# EAGLE design Main-Board (EAGLE 9.5.2)

## Sheet 1 of 3: Main
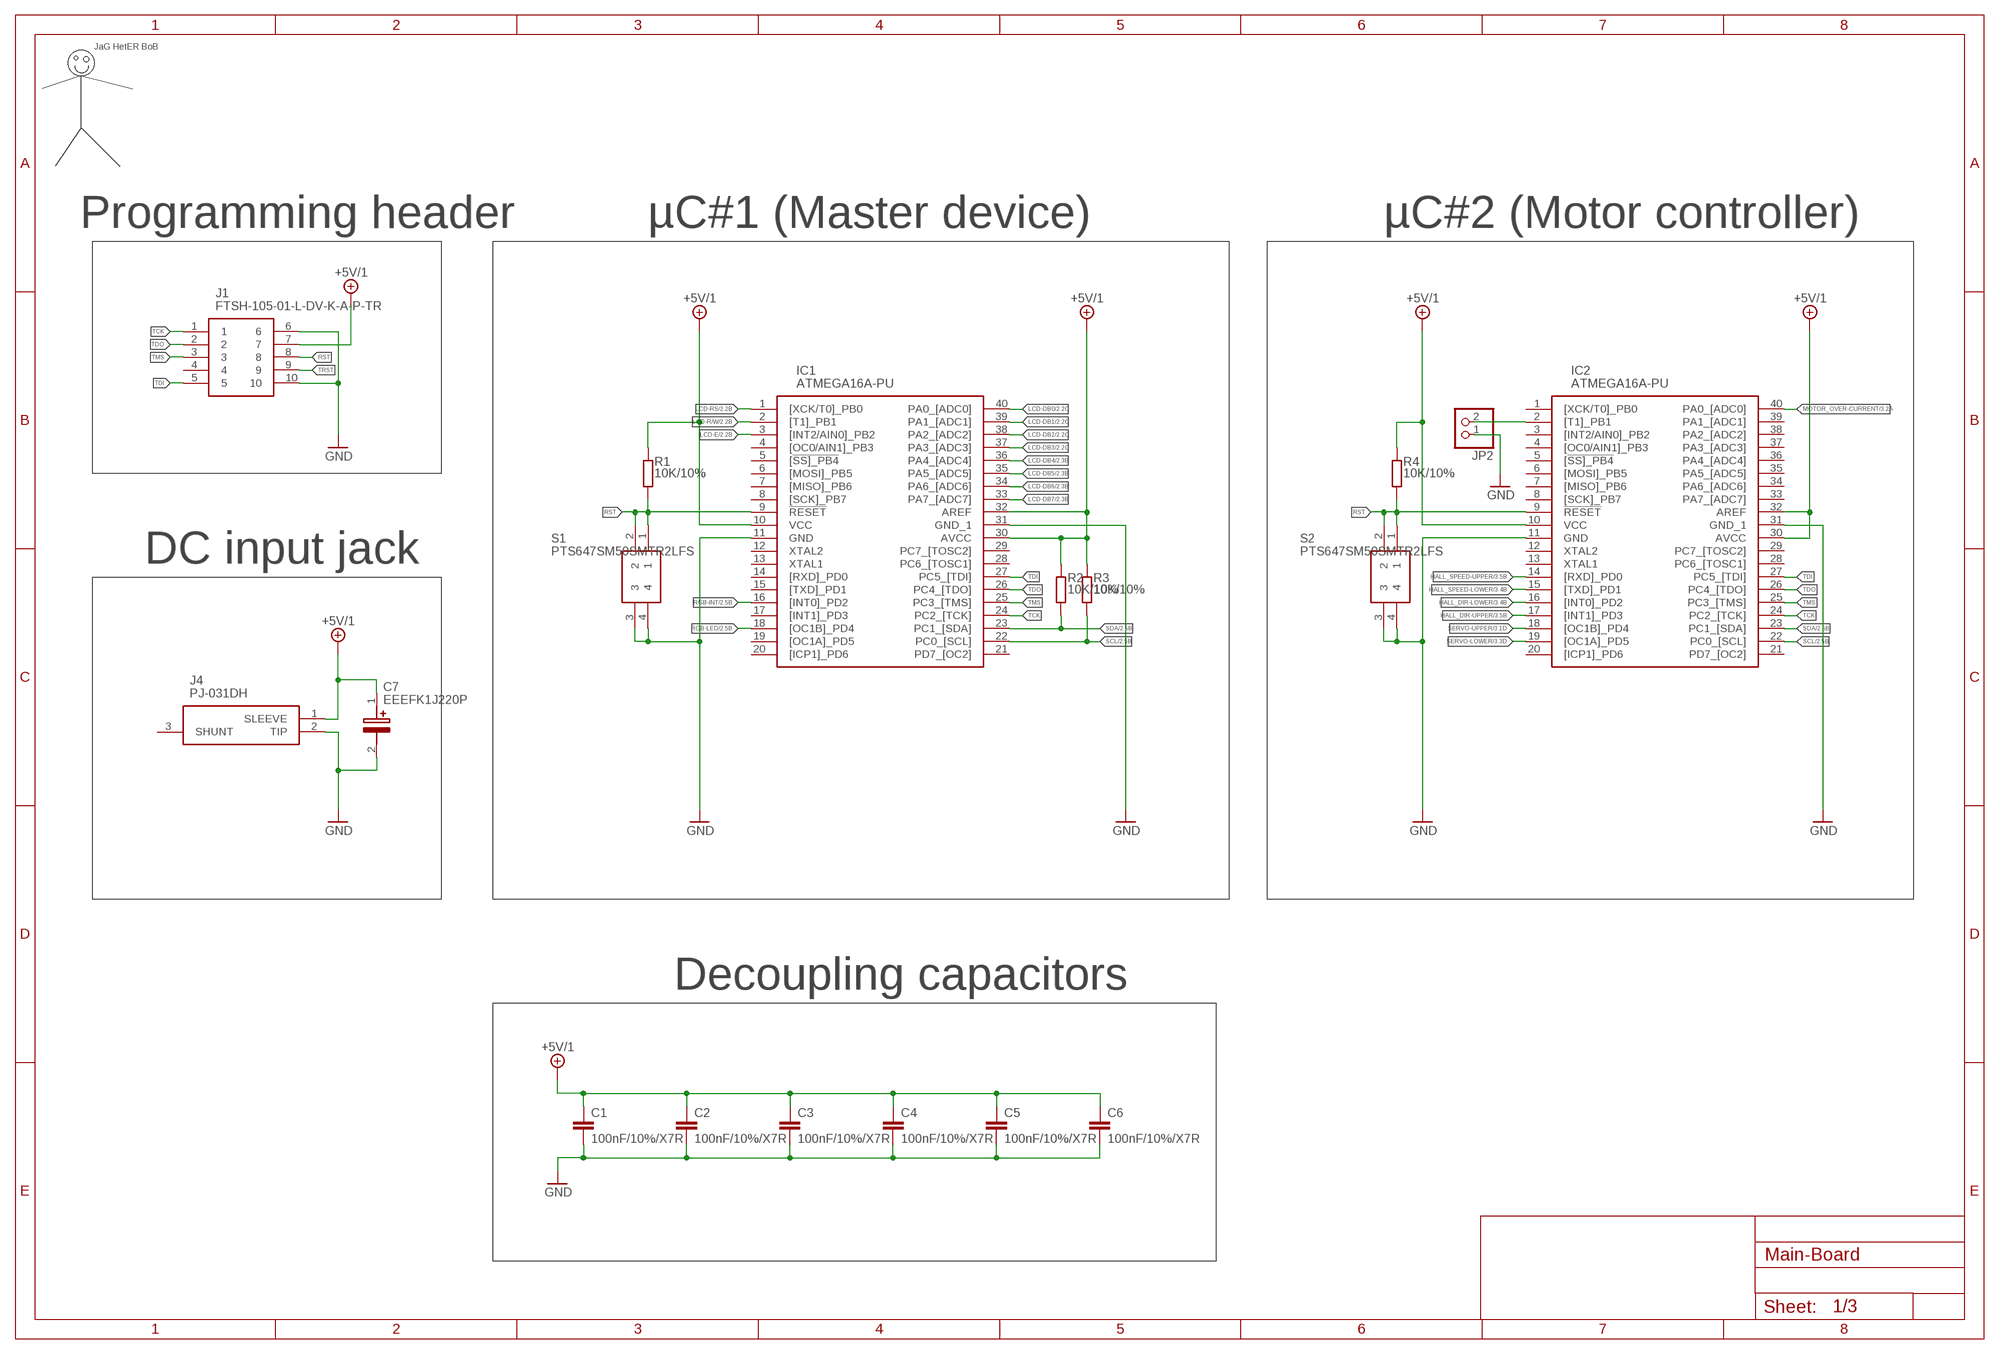
[diagram p0: schematic, sheet 1]

### Parts
C1  100nF/10%/X7R  C-EUC0603  [C0603]
C2  100nF/10%/X7R  C-EUC0603  [C0603]
C3  100nF/10%/X7R  C-EUC0603  [C0603]
C4  100nF/10%/X7R  C-EUC0603  [C0603]
C5  100nF/10%/X7R  C-EUC0603  [C0603]
C6  100nF/10%/X7R  C-EUC0603  [C0603]
C7  EEEFK1J220P  [CAPAE800X650N]
IC1  ATMEGA16A-PU  [DIP1556W56P254L5232H483Q40N]
IC2  ATMEGA16A-PU  [DIP1556W56P254L5232H483Q40N]
J1  FTSH-105-01-L-DV-K-A-P-TR  [FTSH10501LDVKAPTR]
J4  PJ-031DH  [PJ031DH]
JP2  PINHD-1X2  [1X02]
R1  10K/10%  R-EU_R0603  [R0603]
R2  10K/10%  R-EU_R0603  [R0603]
R3  10K/10%  R-EU_R0603  [R0603]
R4  10K/10%  R-EU_R0603  [R0603]
S1  PTS647SM50SMTR2LFS  [PTS647SM50SMTR2LFS]
S2  PTS647SM50SMTR2LFS  [PTS647SM50SMTR2LFS]

### Nets
+5V/1: C1.1 C2.1 C3.1 C4.1 C5.1 C6.1 C7.1(+) IC1.10(VCC) IC1.30(AVCC) IC1.32(AREF) IC2.10(VCC) IC2.30(AVCC) IC2.32(AREF) J1.7 J4.1(SLEEVE) R1.2 R2.2 R3.2 R4.2 ; also sheet 2,3
GND: C1.2 C2.2 C3.2 C4.2 C5.2 C6.2 C7.2(-) IC1.11(GND) IC1.31(GND_1) IC2.11(GND) IC2.31(GND_1) J1.6 J1.10 J4.2(TIP) JP2.1 S1.3 S1.4 S2.3 S2.4 ; also sheet 2,3
HALL_DIR-LOWER: IC2.16([INT0]_PD2) ; also sheet 3
HALL_DIR-UPPER: IC2.17([INT1]_PD3) ; also sheet 3
HALL_SPEED-LOWER: IC2.15([TXD]_PD1) ; also sheet 3
HALL_SPEED-UPPER: IC2.14([RXD]_PD0) ; also sheet 3
LCD-DB0: IC1.40(PA0_[ADC0]) ; also sheet 2
LCD-DB1: IC1.39(PA1_[ADC1]) ; also sheet 2
LCD-DB2: IC1.38(PA2_[ADC2]) ; also sheet 2
LCD-DB3: IC1.37(PA3_[ADC3]) ; also sheet 2
LCD-DB4: IC1.36(PA4_[ADC4]) ; also sheet 2
LCD-DB5: IC1.35(PA5_[ADC5]) ; also sheet 2
LCD-DB6: IC1.34(PA6_[ADC6]) ; also sheet 2
LCD-DB7: IC1.33(PA7_[ADC7]) ; also sheet 2
LCD-E: IC1.3([INT2/AIN0]_PB2) ; also sheet 2
LCD-R/W: IC1.2([T1]_PB1) ; also sheet 2
LCD-RS: IC1.1([XCK/T0]_PB0) ; also sheet 2
MOTOR_OVER-CURRENT: IC2.40(PA0_[ADC0]) ; also sheet 3
N$3: IC2.2([T1]_PB1) JP2.2
RGB-INT: IC1.16([INT0]_PD2) ; also sheet 2
RGB-LED: IC1.18([OC1B]_PD4) ; also sheet 2
RST: IC1.9(!RESET) IC2.9(!RESET) J1.8 R1.1 R4.1 S1.1 S1.2 S2.1 S2.2
SCL: IC1.22(PC0_[SCL]) IC2.22(PC0_[SCL]) R3.1 ; also sheet 2
SDA: IC1.23(PC1_[SDA]) IC2.23(PC1_[SDA]) R2.1 ; also sheet 2
SERVO-LOWER: IC2.19([OC1A]_PD5) ; also sheet 3
SERVO-UPPER: IC2.18([OC1B]_PD4) ; also sheet 3
TCK: IC1.24(PC2_[TCK]) IC2.24(PC2_[TCK]) J1.1
TDI: IC1.27(PC5_[TDI]) IC2.27(PC5_[TDI]) J1.5
TDO: IC1.26(PC4_[TDO]) IC2.26(PC4_[TDO]) J1.2
TMS: IC1.25(PC3_[TMS]) IC2.25(PC3_[TMS]) J1.3
TRST: J1.9
Unconnected: IC1.4([OC0/AIN1]_PB3) IC1.5([!SS]_PB4) IC1.6([MOSI]_PB5) IC1.7([MISO]_PB6) IC1.8([SCK]_PB7) IC1.12(XTAL2) IC1.13(XTAL1) IC1.14([RXD]_PD0) IC1.15([TXD]_PD1) IC1.17([INT1]_PD3) IC1.19([OC1A]_PD5) IC1.20([ICP1]_PD6) IC1.21(PD7_[OC2]) IC1.28(PC6_[TOSC1]) IC1.29(PC7_[TOSC2]) IC2.1([XCK/T0]_PB0) IC2.3([INT2/AIN0]_PB2) IC2.4([OC0/AIN1]_PB3) IC2.5([!SS]_PB4) IC2.6([MOSI]_PB5) IC2.7([MISO]_PB6) IC2.8([SCK]_PB7) IC2.12(XTAL2) IC2.13(XTAL1) IC2.20([ICP1]_PD6) IC2.21(PD7_[OC2]) IC2.28(PC6_[TOSC1]) IC2.29(PC7_[TOSC2]) IC2.33(PA7_[ADC7]) IC2.34(PA6_[ADC6]) IC2.35(PA5_[ADC5]) IC2.36(PA4_[ADC4]) IC2.37(PA3_[ADC3]) IC2.38(PA2_[ADC2]) IC2.39(PA1_[ADC1]) J1.4 J4.3(SHUNT)

### Notes on the sheet
- JaG HetER BoB
- Programming header | µC#1 (Master device) | µC#2 (Motor controller)
- DC input jack
- Decoupling capacitors

## Sheet 2 of 3: Peripherals
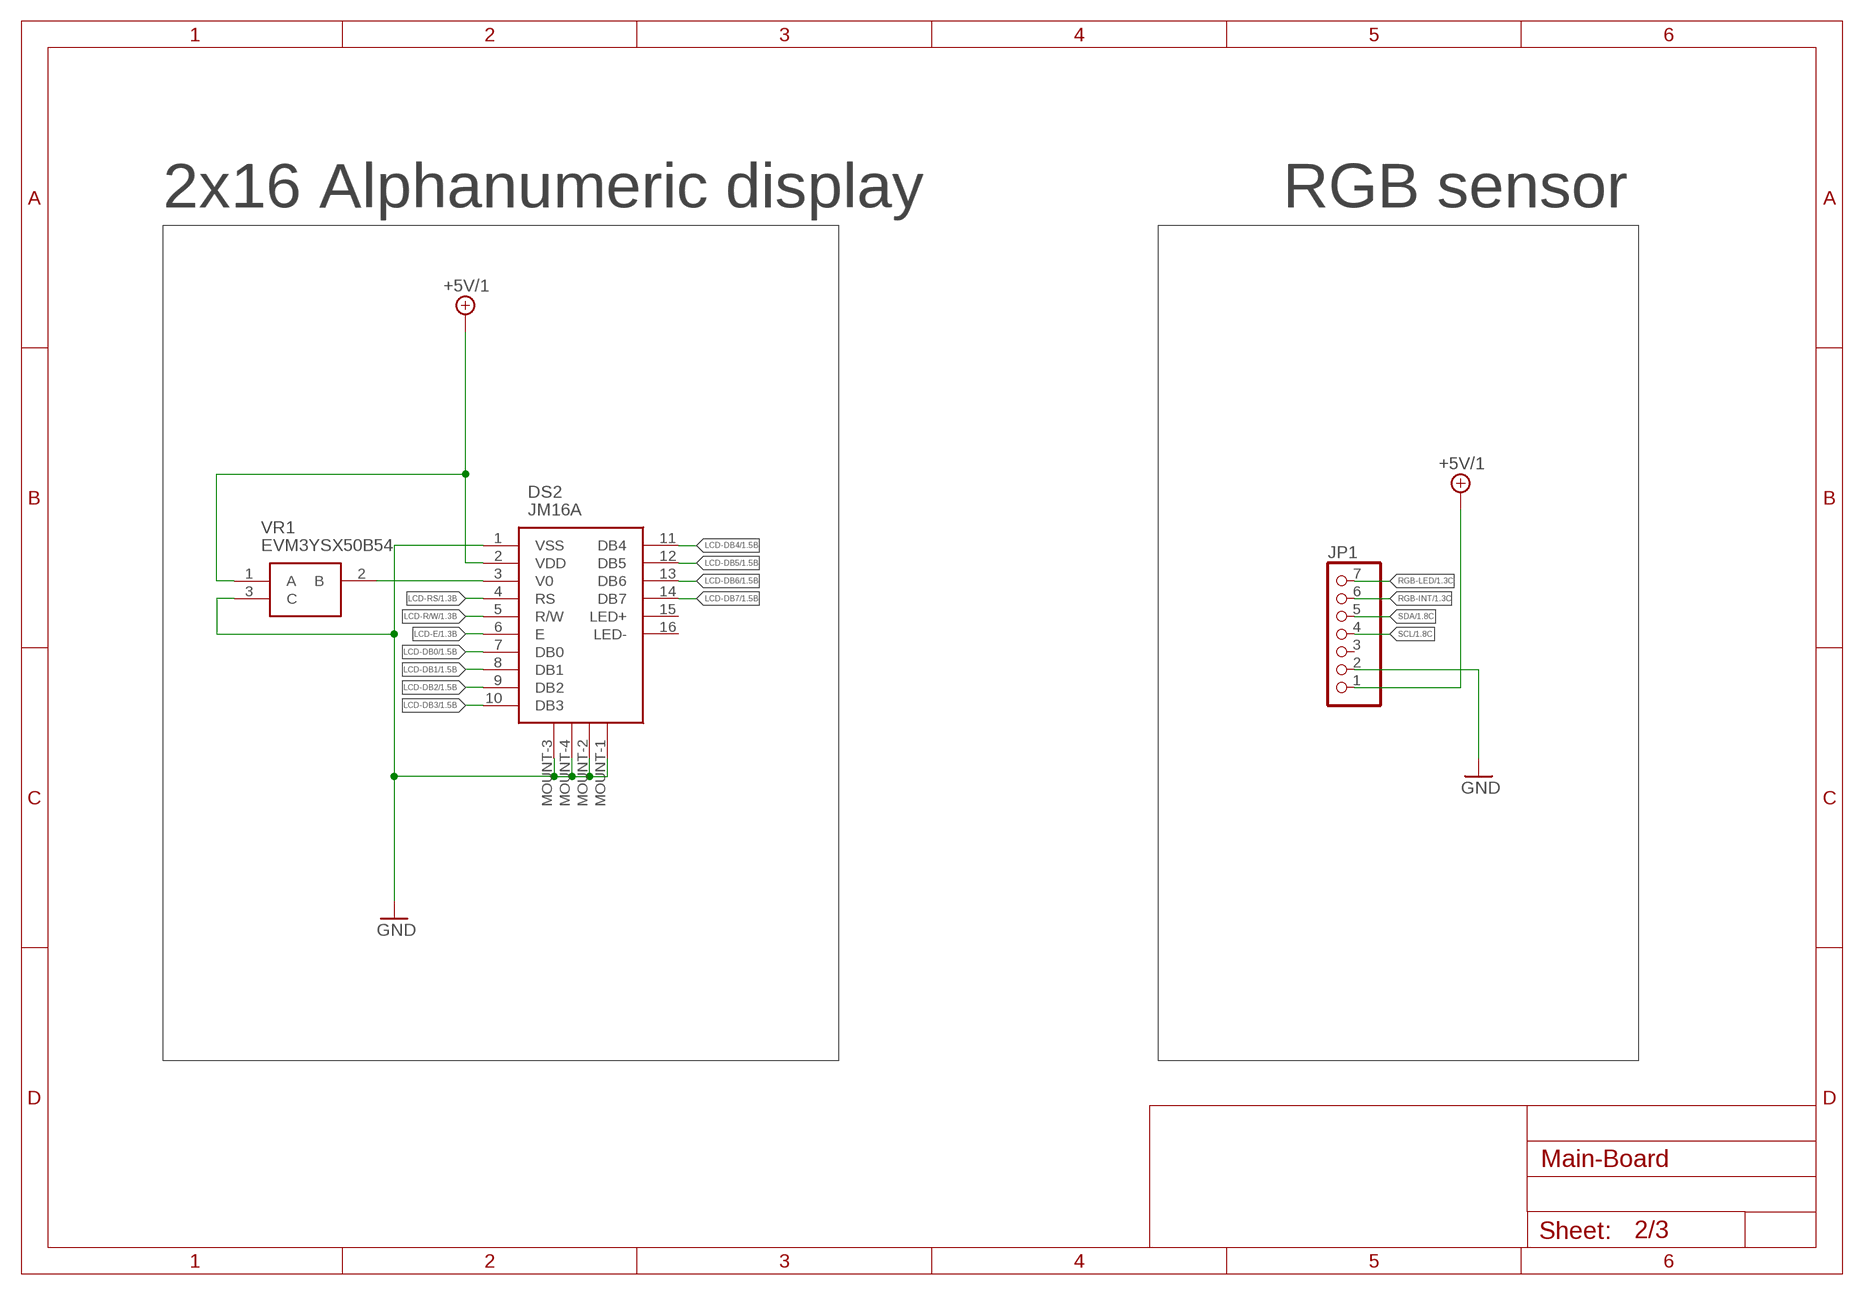
[diagram p1: schematic, sheet 2]

### Parts
DS2  JM16A  [JM16A]
JP1  PINHD-1X7  [1X07]
VR1  EVM3YSX50B54  [EVM3YSX50B54]

### Nets
+5V/1: DS2.2(VDD) JP1.1 VR1.1(A) ; also sheet 1,3
GND: DS2.1(VSS) DS2.MOUNT-1(MOUNT-4) DS2.MOUNT-2(MOUNT-3) DS2.MOUNT-3(MOUNT-1) DS2.MOUNT-4(MOUNT-2) JP1.2 VR1.3(C) ; also sheet 1,3
LCD-DB0: DS2.7(DB0) ; also sheet 1
LCD-DB1: DS2.8(DB1) ; also sheet 1
LCD-DB2: DS2.9(DB2) ; also sheet 1
LCD-DB3: DS2.10(DB3) ; also sheet 1
LCD-DB4: DS2.11(DB4) ; also sheet 1
LCD-DB5: DS2.12(DB5) ; also sheet 1
LCD-DB6: DS2.13(DB6) ; also sheet 1
LCD-DB7: DS2.14(DB7) ; also sheet 1
LCD-E: DS2.6(E) ; also sheet 1
LCD-R/W: DS2.5(R/W) ; also sheet 1
LCD-RS: DS2.4(RS) ; also sheet 1
N$2: DS2.3(V0) VR1.2(B)
RGB-INT: JP1.6 ; also sheet 1
RGB-LED: JP1.7 ; also sheet 1
SCL: JP1.4 ; also sheet 1
SDA: JP1.5 ; also sheet 1
Unconnected: DS2.15(LED+) DS2.16(LED-) JP1.3

### Notes on the sheet
- 2x16 Alphanumeric display | RGB sensor

## Sheet 3 of 3: Motor
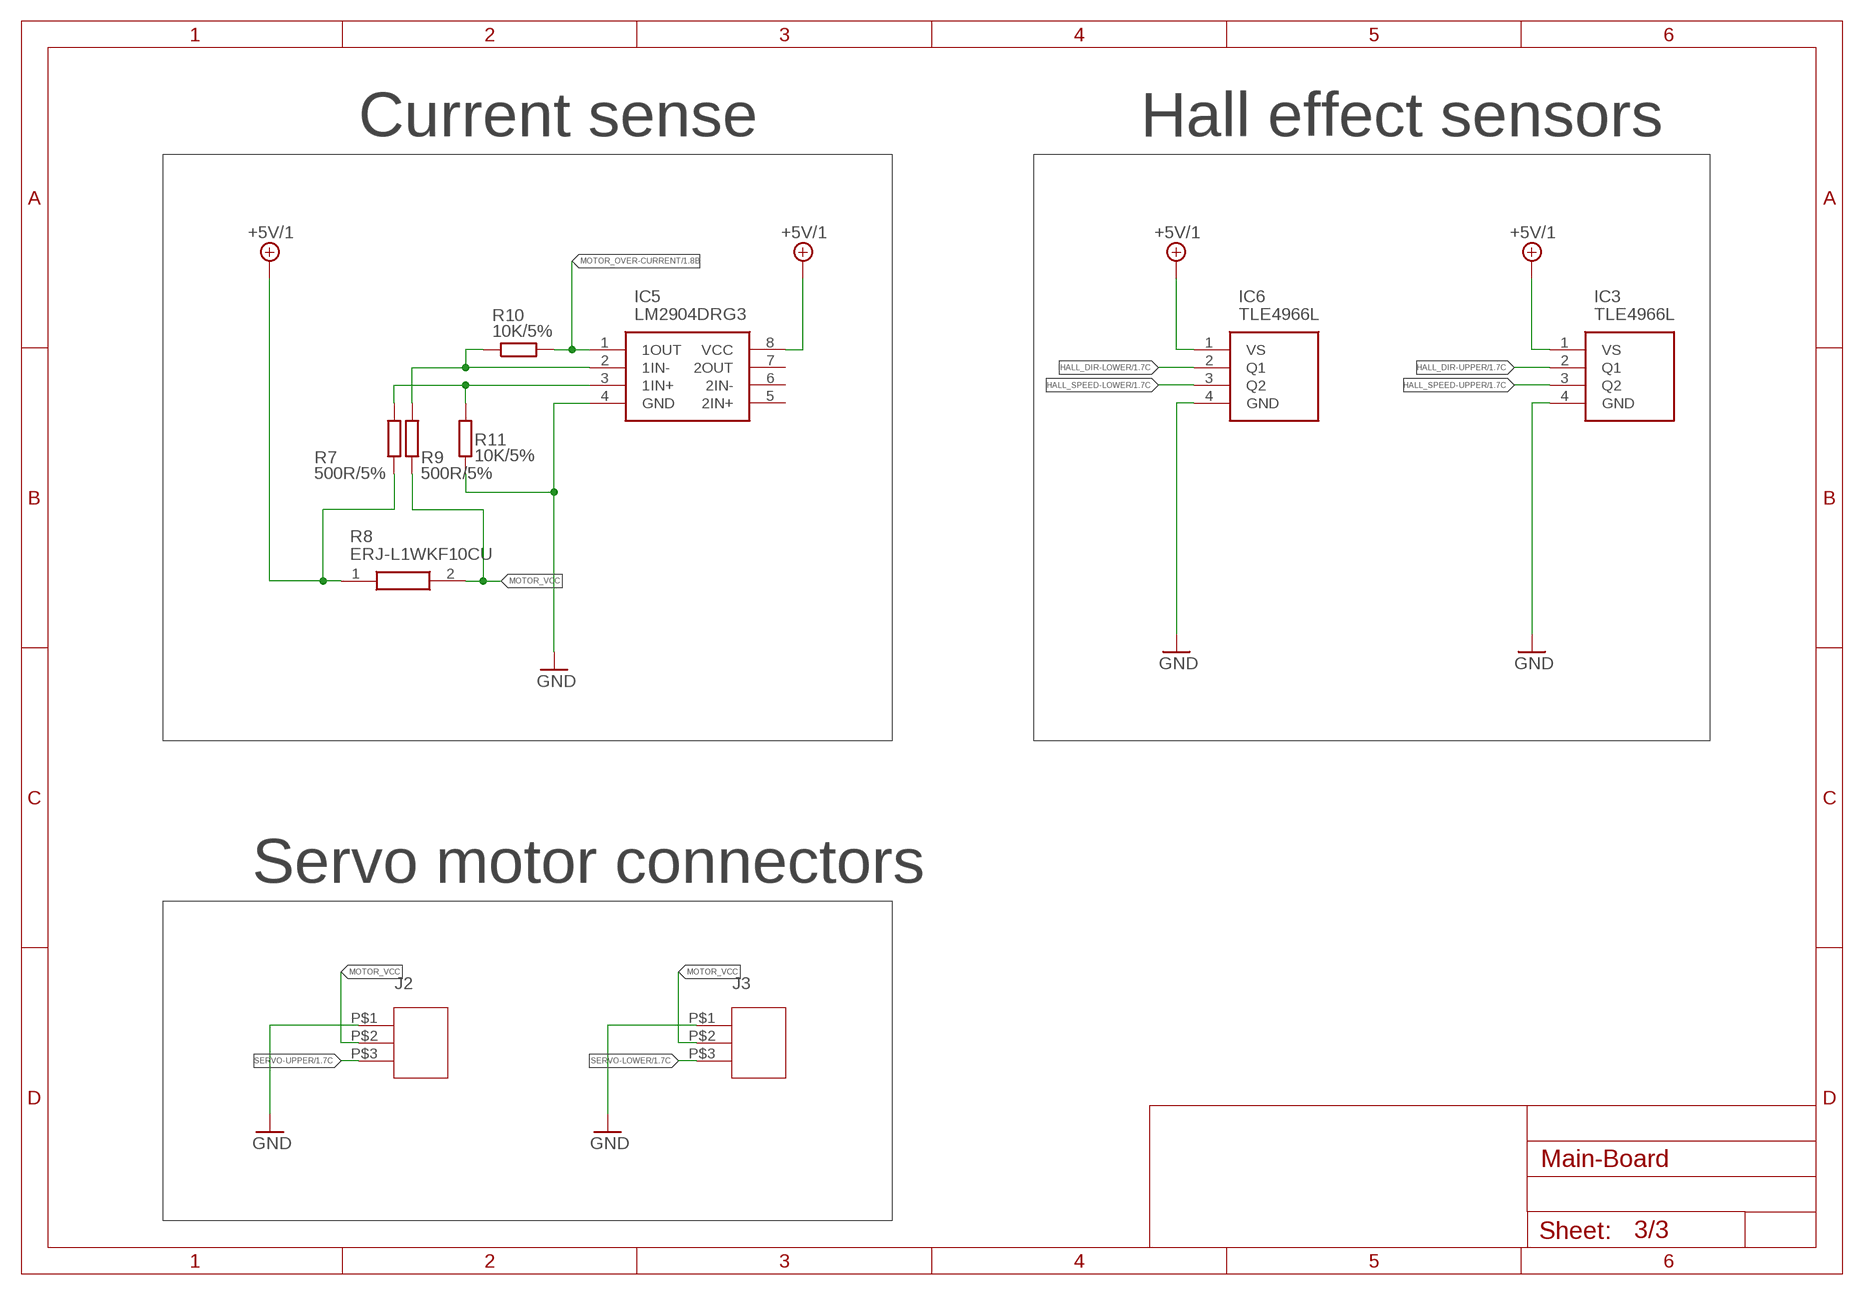
[diagram p2: schematic, sheet 3]

### Parts
IC3  TLE4966L  [TLE4966L]
IC5  LM2904DRG3  [SOIC127P600X175-8N]
IC6  TLE4966L  [TLE4966L]
J2  0022288033  [0022288033]
J3  0022288033  [0022288033]
R7  500R/5%  R-EU_R0603  [R0603]
R8  ERJ-L1WKF10CU  [RESC6332X120N]
R9  500R/5%  R-EU_R0603  [R0603]
R10  10K/5%  R-EU_R0603  [R0603]
R11  10K/5%  R-EU_R0603  [R0603]

### Nets
+5V/1: IC3.1(VS) IC5.8(VCC) IC6.1(VS) R7.1 R8.1(R1) ; also sheet 1,2
GND: IC3.4(GND) IC5.4(GND) IC6.4(GND) J2.P$1 J3.P$1 R11.1 ; also sheet 1,2
HALL_DIR-LOWER: IC6.2(Q1) ; also sheet 1
HALL_DIR-UPPER: IC3.2(Q1) ; also sheet 1
HALL_SPEED-LOWER: IC6.3(Q2) ; also sheet 1
HALL_SPEED-UPPER: IC3.3(Q2) ; also sheet 1
MOTOR_OVER-CURRENT: IC5.1(1OUT) R10.2 ; also sheet 1
MOTOR_VCC: J2.P$2 J3.P$2 R8.2(R2) R9.1
N$1: IC5.3(1IN+) R7.2 R11.2
N$5: IC5.2(1IN-) R9.2 R10.1
SERVO-LOWER: J3.P$3 ; also sheet 1
SERVO-UPPER: J2.P$3 ; also sheet 1
Unconnected: IC5.5(2IN+) IC5.6(2IN-) IC5.7(2OUT)

### Notes on the sheet
- Current sense | Hall effect sensors
- Servo motor connectors

## Library data of the parts
C1-C6 = rcl:C-EU: CAPACITOR, European symbol; SPICEPREFIX: C
C7 = SamacSys_Parts:EEEFK1J220P: Panasonic Aluminium Electrolytic Capacitor 22uF 63V dc 8mm E FK SMD Series, Surface Mount Electrolytic, +/-20% Source: Datasheet <https://industrial.panasonic.com/cdbs/www-data/pdf/RDE0000/ABA0000C1181.pdf>; DESCRIPTION: Panasonic Aluminium Electrolytic Capacitor 22uF 63V dc 8mm E FK SMD Series, Surface Mount Electrolytic, +/-20%; HEIGHT: 6.5mm; MANUFACTURER_NAME: Panasonic; MANUFACTURER_PART_NUMBER: EEEFK1J220P; RS_PART_NUMBER: 7083598P; RS_PRICE-STOCK: http://uk.rs-online.com/web/p/products/7083598P
DS2 = JM16A-Vanheden:JM16A: LCD Character Display Modules & Accessories STN- GRAY Transfl 80.0 x 36.0 Source: Datasheet <http://www.newhavendisplay.com/specs/NHD-0216XZ-FSW-GBW.pdf>; ALLIED_NUMBER: 70518104; ALLIED_PRICE-STOCK: https://www.alliedelec.com/newhaven-display-international-nhd-0216xz-fsw-gbw/70518104/; DESCRIPTION: LCD Character Display Modules & Accessories STN- GRAY Transfl 80.0 x 36.0; HEIGHT: 7mm; MANUFACTURER_NAME: Newhaven Display; MANUFACTURER_PART_NUMBER: NHD-0216XZ-FSW-GBW; MOUSER_PART_NUMBER: 763-0216XZ-FSW-GBW; MOUSER_PRICE-STOCK: https://www.mouser.com/Search/Refine.aspx?Keyword=763-0216XZ-FSW-GBW
IC1 IC2 = SamacSys_Parts:ATMEGA16A-PU: ATMEGA16A-PU, 8 bit AVR Microcontroller 16MHz 16 kB, 512 B Flash, 1 kB RAM, I2C 40-Pin PDIP Source: Datasheet <http://www.atmel.com/images/atmel-8154-8-bit-avr-atmega16a_datasheet summary.pdf>; DESCRIPTION: ATMEGA16A-PU, 8 bit AVR Microcontroller 16MHz 16 kB, 512 B Flash, 1 kB RAM, I2C 40-Pin PDIP; HEIGHT: 4.826mm; MANUFACTURER_NAME: Microchip; MANUFACTURER_PART_NUMBER: ATMEGA16A-PU; MOUSER_PART_NUMBER: 556-ATMEGA16A-PU; MOUSER_PRICE-STOCK: https://www.mouser.com/Search/Refine.aspx?Keyword=556-ATMEGA16A-PU; RS_PART_NUMBER: 6962421P; RS_PRICE-STOCK: http://uk.rs-online.com/web/p/products/6962421P
IC3 IC6 = SamacSys_Parts:TLE4966L: Infineon TLE4966L, Bipolar Hall Effect Sensor Switch 4-Pin SSO, 2.7 26 V Source: Datasheet <https://www.infineon.com/dgdl/Infineon-TLE4966L-DS-v02_00-en.pdf?fileId=db3a304319c6f18c0119cd85b86f7ad7>; DESCRIPTION: Infineon TLE4966L, Bipolar Hall Effect Sensor Switch 4-Pin SSO, 2.7 26 V; HEIGHT: 3.89mm; MANUFACTURER_NAME: Infineon; MANUFACTURER_PART_NUMBER: TLE4966L; MOUSER_PART_NUMBER: 726-TLE4966L; MOUSER_PRICE-STOCK: https://www.mouser.com/Search/Refine.aspx?Keyword=726-TLE4966L
IC5 = SamacSys_Parts:LM2904DRG3: Dual general-purpose operational amplifier Source: Datasheet <http://www.ti.com/lit/gpn/lm2904>; DESCRIPTION: Dual general-purpose operational amplifier; HEIGHT: mm; MANUFACTURER_NAME: Texas Instruments; MANUFACTURER_PART_NUMBER: LM2904DRG3; MOUSER_PART_NUMBER: 595-LM2904DRG3; MOUSER_PRICE-STOCK: https://www.mouser.com/Search/Refine.aspx?Keyword=595-LM2904DRG3
J1 = SamacSys_Parts:FTSH-105-01-L-DV-K-A-P-TR: Samtec FTSH, 1.27mm Pitch, 10 Way, 2 Row PCB Terminal Block Header, Surface Mount, Through Hole Source: Datasheet <http://suddendocs.samtec.com/prints/ftsh-1xx-xx-xxx-dv-xxx-xxx-mkt.pdf>; DESCRIPTION: Samtec FTSH, 1.27mm Pitch, 10 Way, 2 Row PCB Terminal Block Header, Surface Mount, Through Hole; HEIGHT: 6.1mm; MANUFACTURER_NAME: SAMTEC; MANUFACTURER_PART_NUMBER: FTSH-105-01-L-DV-K-A-P-TR; MOUSER_PART_NUMBER: 200-FTSH1051LDVKAPTR; MOUSER_PRICE-STOCK: https://www.mouser.com/Search/Refine.aspx?Keyword=200-FTSH1051LDVKAPTR; RS_PART_NUMBER: 1802978P; RS_PRICE-STOCK: http://uk.rs-online.com/web/p/products/1802978P
J2 J3 = 0022288033:0022288033
J4 = SamacSys_Parts:PJ-031DH: DC Power Connectors Power Jacks Source: Datasheet <https://www.cuidevices.com/product/resource/pj-031dh.pdf>; DESCRIPTION: DC Power Connectors Power Jacks; HEIGHT: 7.4mm; MANUFACTURER_NAME: CUI Devices; MANUFACTURER_PART_NUMBER: PJ-031DH; MOUSER_PART_NUMBER: 490-PJ-031DH; MOUSER_PRICE-STOCK: https://www.mouser.com/Search/Refine.aspx?Keyword=490-PJ-031DH
JP1 = pinhead:PINHD-1X7: PIN HEADER
JP2 = pinhead:PINHD-1X2: PIN HEADER
R1-R4 R7 R9-R11 = rcl:R-EU_: RESISTOR, European symbol; SPICEPREFIX: R
R8 = SamacSys_Parts:ERJ-L1WKF10CU: RESISTOR, 2512 100 mOhm +/-1% 1W Source: Datasheet <http://componentsearchengine.com/Datasheets/1/ERJ-L1WKF10CU.pdf>; ALLIED_NUMBER: 70260913; ALLIED_PRICE-STOCK: https://www.alliedelec.com/panasonic-erj-l1wkf10cu/70260913/; DESCRIPTION: RESISTOR, 2512 100 mOhm +/-1% 1W; HEIGHT: mm; MANUFACTURER_NAME: Panasonic; MANUFACTURER_PART_NUMBER: ERJ-L1WKF10CU; MOUSER_PART_NUMBER: 667-ERJ-L1WKF10CU; MOUSER_PRICE-STOCK: https://www.mouser.com/Search/Refine.aspx?Keyword=667-ERJ-L1WKF10CU
S1 S2 = SamacSys_Parts:PTS647SM50SMTR2LFS: Tactile Switches 50mA 12VDC, 1.8N 5.0mm H, G leads Source: Datasheet <https://www.ckswitches.com/media/2567/pts647.pdf>; DESCRIPTION: Tactile Switches 50mA 12VDC, 1.8N 5.0mm H, G leads; HEIGHT: 5.25mm; MANUFACTURER_NAME: C & K COMPONENTS; MANUFACTURER_PART_NUMBER: PTS647SM50SMTR2LFS; MOUSER_PART_NUMBER: 611-PTS647SM50SMTR2L; MOUSER_PRICE-STOCK: https://www.mouser.com/Search/Refine.aspx?Keyword=611-PTS647SM50SMTR2L
VR1 = SamacSys_Parts:EVM3YSX50B54: SMD Cermet Trimmer Pot, 3mm Sq, 50K Source: Datasheet <http://docs-emea.rs-online.com/webdocs/0f7f/0900766b80f7fa29.pdf>; ALLIED_NUMBER: 70348375; ALLIED_PRICE-STOCK: http://www.alliedelec.com/panasonic-evm3ysx50b54/70348375/; DESCRIPTION: SMD Cermet Trimmer Pot, 3mm Sq, 50K; HEIGHT: 1.55mm; MANUFACTURER_NAME: Panasonic; MANUFACTURER_PART_NUMBER: EVM3YSX50B54; RS_PART_NUMBER: 7312880; RS_PRICE-STOCK: https://uk.rs-online.com/web/p/products/7312880

## Board
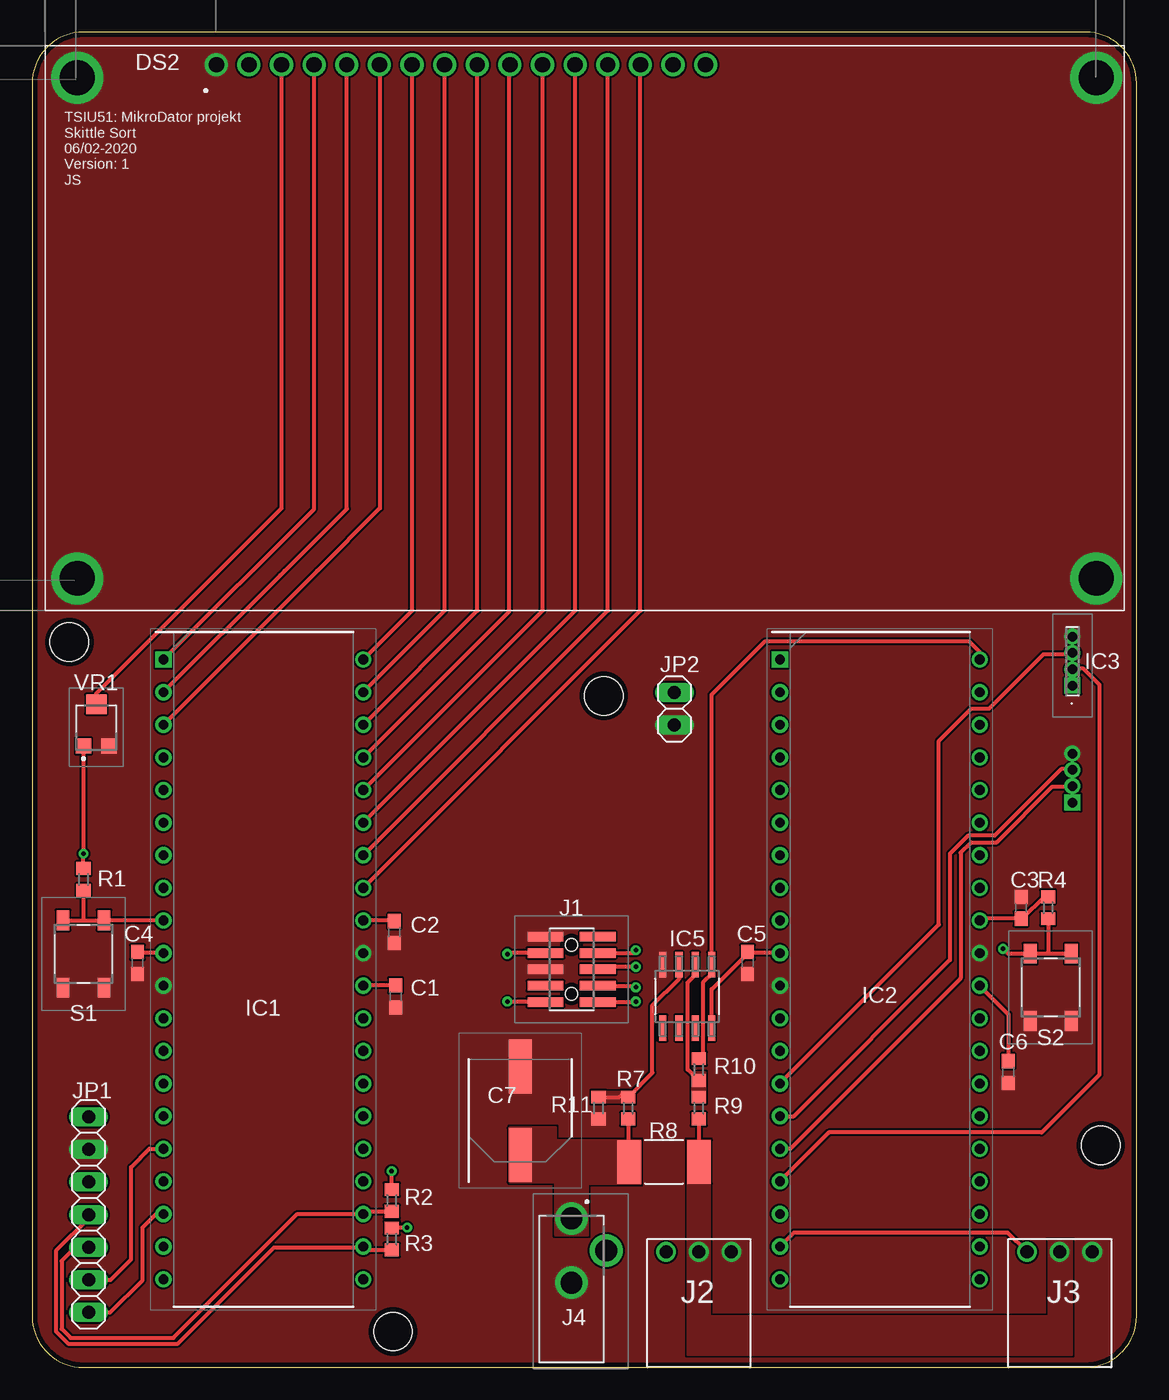
[diagram p3: board, top side]
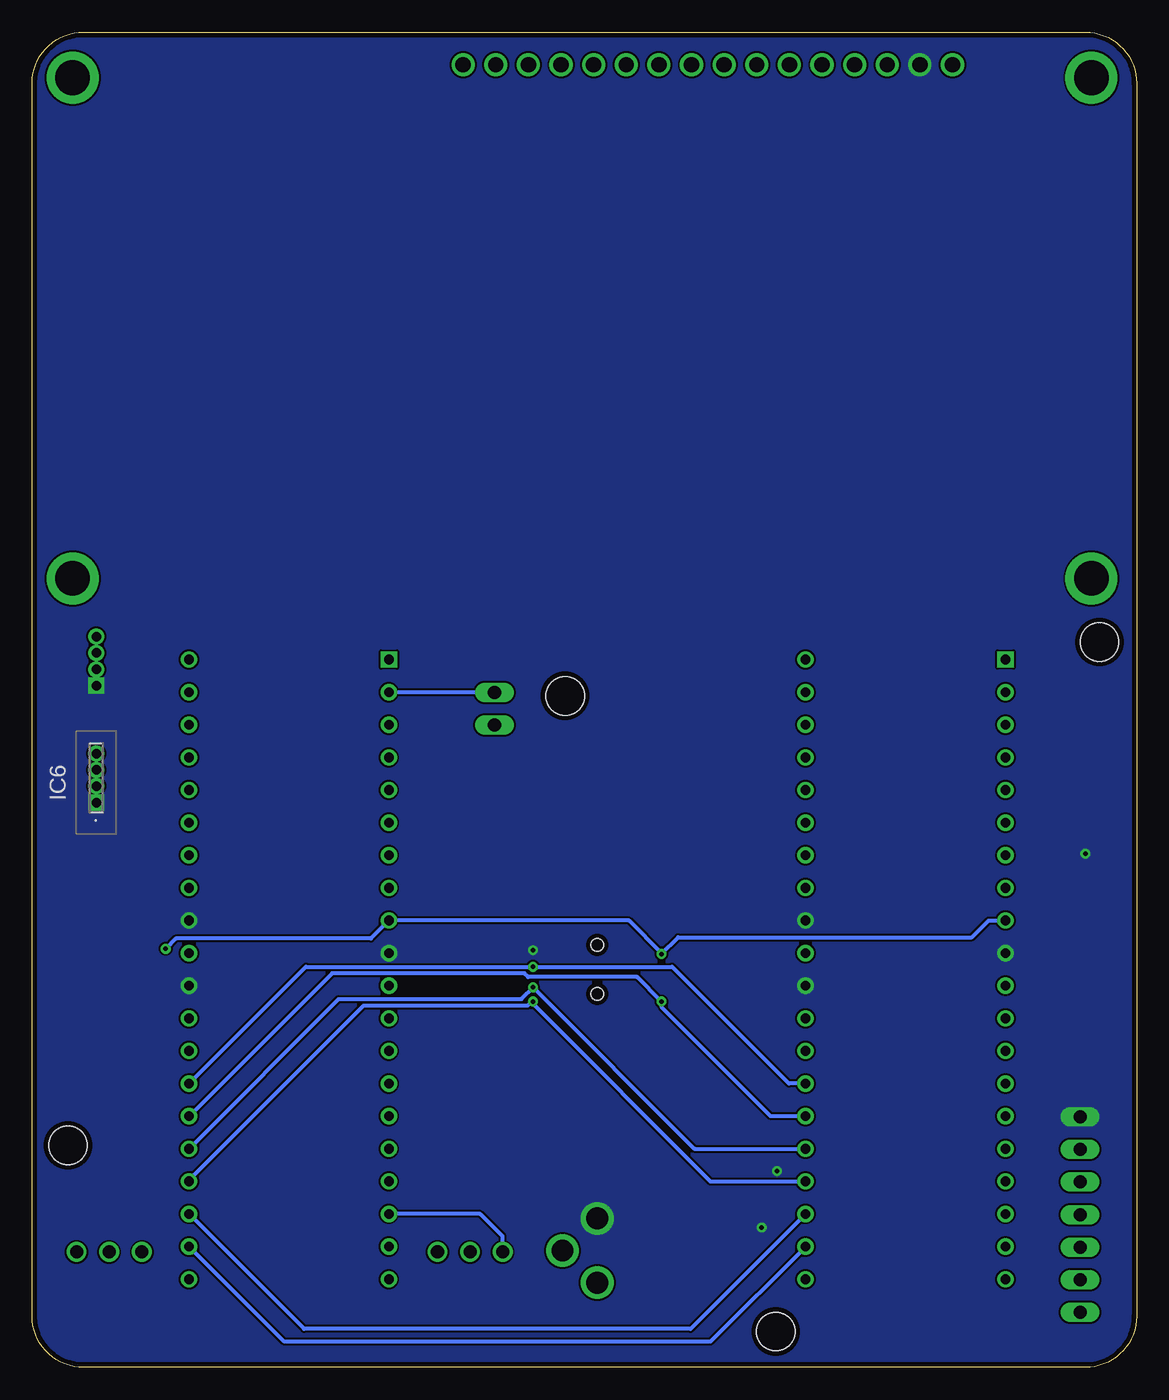
[diagram p4: board, bottom side, seen from below]

Size 86 x 104 mm. Coordinates in mm from the lower left corner, seen from the top.
Outline: 86,4 86,100 arc90 82,104 4,104 arc90 0,100 0,4 arc90 4,0 82,0 arc90 86,4
Copper layers (1*16): Top 0.035mm / dielectric 1.5mm / Bottom 0.035mm
Design rules "default *": minimum track width 6mil, minimum drill 0.35mm, track to track 6mil, track to pad 6mil, pad to pad 6mil, via to via 6mil, smd to smd 6mil, copper to edge 15mil, drill to drill 6mil, minimum pad ring 10mil, minimum via ring 8mil, stop-mask expansion 4mil, vias tented up to drill 20mil, thermal gap 10mil
Holes 3 mm at 28.1,2.8 2.9,56.5 83.2,17.3 44.5,52.3

### Footprints (pad centres in the part's own frame; a part is rotated, then mirrored left to right if it is on the bottom)
C0603 = smd 1.1 x 1: 1 -0.85,0; 2 0.85,0
CAPAE800X650N = smd 4.2 x 1.8: 1 -3.45,0; 2 3.45,0
JM16A = drill 1.2 pad 1.8: 1 13.34,-1.542; 2 15.88,-1.542; 3 18.42,-1.542; 4 20.96,-1.542; 5 23.5,-1.542; 6 26.04,-1.542; 7 28.58,-1.542; 8 31.12,-1.542; 9 33.66,-1.542; 10 36.2,-1.542; 11 38.74,-1.542; 12 41.28,-1.542; 13 43.82,-1.542; 14 46.36,-1.542; 15 48.9,-1.542; 16 51.44,-1.542 | drill 2.7 pad 4.05: MOUNT-1 2.521,-2.55; MOUNT-2 81.85,-2.55; MOUNT-3 2.521,-41.55; MOUNT-4 81.85,-41.55
DIP1556W56P254L5232H483Q40N = drill 0.759 pad 1.159 square: 1 -7.779,24.13 | drill 0.759 pad 1.159: 2 -7.779,21.59; 3 -7.779,19.05; 4 -7.779,16.51; 5 -7.779,13.97; 6 -7.779,11.43; 7 -7.779,8.89; 8 -7.779,6.35; 9 -7.779,3.81; 10 -7.779,1.27; 11 -7.779,-1.27; 12 -7.779,-3.81; 13 -7.779,-6.35; 14 -7.779,-8.89; 15 -7.779,-11.43; 16 -7.779,-13.97; 17 -7.779,-16.51; 18 -7.779,-19.05; 19 -7.779,-21.59; 20 -7.779,-24.13; 21 7.779,-24.13; 22 7.779,-21.59; 23 7.779,-19.05; 24 7.779,-16.51; 25 7.779,-13.97; 26 7.779,-11.43; 27 7.779,-8.89; 28 7.779,-6.35; 29 7.779,-3.81; 30 7.779,-1.27; 31 7.779,1.27; 32 7.779,3.81; 33 7.779,6.35; 34 7.779,8.89; 35 7.779,11.43; 36 7.779,13.97; 37 7.779,16.51; 38 7.779,19.05; 39 7.779,21.59; 40 7.779,24.13
TLE4966L = drill 0.74 pad 1.1 square: 1 0,0 | drill 0.74 pad 1.1: 2 1.27,0; 3 2.54,0; 4 3.81,0
SOIC127P600X175-8N = smd 1.981 x 0.559: 1 -2.464,1.905; 2 -2.464,0.635; 3 -2.464,-0.635; 4 -2.464,-1.905; 5 2.464,-1.905; 6 2.464,-0.635; 7 2.464,0.635; 8 2.464,1.905
FTSH10501LDVKAPTR = smd 0.74 x 2.79: 1 -2.54,-2.035; 2 -2.54,2.035; 3 -1.27,-2.035; 4 -1.27,2.035; 5 0,-2.035; 6 0,2.035; 7 1.27,-2.035; 8 1.27,2.035; 9 2.54,-2.035; 10 2.54,2.035 | hole 0.97: -1.905,0; 1.905,0
0022288033 = drill 1.02: P$1 -2.54,0; P$2 0,0; P$3 2.54,0
PJ031DH = drill 1.7 pad 2.5: 1 0,0; 2 -5,0; 3 -2.5,-2.7
1X07 = drill 1.016 long: 1 -7.62,0; 2 -5.08,0; 3 -2.54,0; 4 0,0; 5 2.54,0; 6 5.08,0; 7 7.62,0
1X02 = drill 1.016 long: 1 -1.27,0; 2 1.27,0
R0603 = smd 1 x 1.1: 1 -0.85,0; 2 0.85,0
RESC6332X120N = smd 1.854 x 3.404: 1 -2.718,0; 2 2.718,0
PTS647SM50SMTR2LFS = smd 1.55 x 1: 1 -2.625,1.6; 2 -2.625,-1.6; 3 2.625,-1.6; 4 2.625,1.6
EVM3YSX50B54 = smd 1.2 x 1.2: 1 -1,-1.6; 3 1,-1.6 | smd 1.6 x 1.5: 2 0,1.65

### Placement (x,y rotation side)
C1  28.3,28.9 270 top
C2  28.2,33.9 270 top
C3  77,35.8 90 top
C4  8.2,31.5 270 top
C5  55.7,31.5 270 top
C6  76,23 270 top
C7  38,20 90 top
DS2  1,103 0 top
IC1  18,31 0 top
IC2  66,31 0 top
IC3  81,53.1 90 top
IC5  51,28.9 270 top
IC6  81,44 90 bottom
J1  42,31 90 top
J2  51.9,9 180 top
J3  80,9 180 top
J4  42,11.6 90 top
JP1  4.4,11.9 270 top
JP2  50,51.3 90 top
R1  4,38 90 top
R2  28,13 90 top
R3  28,10 90 top
R4  79.1,35.8 90 top
R7  46.4,20.2 90 top
R8  49.2,16 0 top
R9  51.9,20.2 90 top
R10  51.9,23.2 90 top
R11  44.1,20.2 90 top
S1  4,32.2 270 top
S2  79.3,29.6 270 top
VR1  5,50 0 top

### Tracks (layer width: path | path; a pad name or v marks a point on that pad's centre or on a via)
+5V/1  (via drill 0.35)
  Top 0.305: J1.7 46.77,32.27 v47,32.5 | R2.2 v28,15.3 | R3.2 28.05,10.9 v29.2,10.9 | R1.2 v4,40 VR1.1 | C2.1 28.14,34.81 IC1.32 | C1.1 25.8,29.75 IC1.30 | IC1.10 8.28,32.27 C4.1 | IC2.32 73.92,34.95 C3.1 77.1,34.95 78.8,36.65 R4.2 | IC2.10 55.78,32.27 C5.1 55.7,32.25 52.91,29.45 IC5.8 | IC2.30 76,27.51 C6.1 | R7.1 46.4,16.08 R8.1
  pour Bottom (rank 3, no thermals): -2,104 86,104 86,-3 -2,-3
  pour Top (no thermals): 47.4,17.7 40.7,17.7 40.7,10.3 43.3,10.3 43.3,14.3 47.4,14.3
  pour Top (no thermals): 40.8,18.7 37.2,18.7 37.2,14.4 40.8,14.4
GND
  pour Top (rank 3, no thermals): -1,-1 -1,104 86,104 86,-1
HALL_DIR-LOWER
  Top 0.305: IC6.2 80.96,45.23 79.43,45.23 75.1,40.9 73.1,40.9 72.3,40.1 72.3,30.3 59.03,17.03 IC2.16
HALL_DIR-UPPER
  Top 0.305: IC3.2 81.06,54.43 81.85,54.43 83.1,53.18 83.1,22.8 78.6,18.3 62.03,18.3 IC2.17
HALL_SPEED-LOWER
  Top 0.305: IC6.3 80.94,46.6 80.12,46.6 74.94,41.43 72.89,41.43 71.46,39.99 71.46,31.72 59.31,19.57 IC2.15
HALL_SPEED-UPPER
  Top 0.305: IC2.14 70.6,34.49 70.6,48.8 73.1,51.3 74.5,51.3 78.74,55.54 80.9,55.54 IC3.3
LCD-DB0
  Top 0.305: IC1.40 29.58,58.93 DS2.7
LCD-DB1
  Top 0.305: IC1.39 32.12,58.93 DS2.8
LCD-DB2
  Top 0.305: DS2.9 34.66,58.93 IC1.38
LCD-DB3
  Top 0.305: IC1.37 37.13,58.87 37.13,101.39 DS2.10
LCD-DB4
  Top 0.305: DS2.11 39.74,58.93 IC1.36
LCD-DB5
  Top 0.305: DS2.12 42.28,58.93 IC1.35
LCD-DB6
  Top 0.305: DS2.13 44.82,58.93 IC1.34
LCD-DB7
  Top 0.305: DS2.14 47.36,58.93 IC1.33
LCD-E
  Top 0.305: IC1.3 22.09,61.91 22.2,62.03 27.09,66.91 27.09,101.41 DS2.6
LCD-R/W
  Top 0.305: IC1.2 19.32,61.68 19.66,62.03 24.5,66.87 DS2.5
LCD-RS
  Top 0.305: DS2.4 21.96,66.87 IC1.1
MOTOR_OVER-CURRENT
  Top 0.305: R10.2 52.22,24.37 52.22,29.98 52.91,30.66 IC5.1 52.91,52.41 57.03,56.53 72.98,56.53 73.78,55.73 IC2.40
MOTOR_VCC
  Top 0.305: R9.1 51.92,19.33 R8.2
  pour Top (no thermals): 51,17.7 51,1 81,1 81,9.9 79.1,9.9 79.1,4 52.8,4 52.8,17.7
N$1
  Top 0.305: R11.2 45.7,21.05 46.03,21.39 | IC5.3 50.37,30.27 48.3,28.2 48.3,22.95 R7.2
  pour Top (no thermals): 43.6,21.5 46.9,21.5 46.9,20.6 43.6,20.6
N$2
  Top 0.305: VR1.2 5,52.51 19.42,66.92 DS2.3
N$3
  Bottom 0.305: JP2.2 58.2,52.57 IC2.2
N$5
  Top 0.305: R10.1 51.05,23.2 51.05,29.97 51.63,30.56 IC5.2
  pour Top (no thermals): 51.4,20.6 51.4,23 52.4,23 52.4,20.6
RGB-INT
  Top 0.305: JP1.6 6.12,6.82 7.7,8.4 7.7,15.6 9.13,17.03 IC1.16
RGB-LED
  Top 0.305: JP1.7 6.08,4.28 8.6,6.8 8.6,10.9 9.65,11.95 IC1.18
RST  (via drill 0.35)
  Top 0.305: J1.8 37.07,32.27 v37,32.2 | S1.2 4,34.83 | 4,34.83 S1.1 10.21,34.83 IC1.9 | R1.1 4,34.83 | 79,32.23 S2.2 75.97,32.23 v75.6,32.6 | 79,32.23 S2.1 | R4.1 79.1,32.33 79,32.23
  Bottom 0.305: IC1.9 11.52,34.81 12.83,33.5 35.7,33.5 v37,32.2 37,32.3 39.51,34.81 IC2.9 59.63,33.4 74.8,33.4 v75.6,32.6
SCL
  Top 0.305: IC1.22 25.84,9.34 | 25.84,9.34 26.04,9.15 R3.1 | JP1.4 4.4,11.63 1.84,9.07 1.84,2.81 2.81,1.84 11.34,1.84 18.84,9.34 25.84,9.34
  Bottom 0.305: IC1.22 33.19,2 66.37,2 IC2.22
SDA
  Top 0.305: R2.1 25.98,12.15 IC1.23 20.65,11.95 11,2.3 3,2.3 2.3,3 2.3,8.3 3.36,9.36 JP1.5
  Bottom 0.305: IC1.23 34.73,3 64.83,3 IC2.23
SERVO-LOWER
  Top 0.305: J3.P$3 75.96,10.5 59.31,10.5 IC2.19
SERVO-UPPER
  Bottom 0.305: J2.P$3 49.36,10.2 51.11,11.95 IC2.18
TCK  (via drill 0.35)
  Top 0.305: J1.1 46.96,28.46 v47,28.5
  Bottom 0.305: v47,28.5 47,28.3 | IC2.24 73.78,14.59 60.2,28.17 47.43,28.17 47.15,28.45 47,28.3 | 47,28.3 33.19,14.49 IC1.24
TDI  (via drill 0.35)
  Top 0.305: v47,31.2 44.23,31.2 J1.5
  Bottom 0.305: IC2.27 64.68,31.21 v47.01,31.21 v47,31.2 36.17,31.2 27.08,22.11 IC1.27
TDO  (via drill 0.35)
  Top 0.305: J1.2 37.04,28.46 v37,28.5
  Bottom 0.305: IC1.26 28.48,19.57 37,28.09 v37,28.5 38.9,30.4 47.38,30.4 47.68,30.7 62.65,30.7 IC2.26
TMS  (via drill 0.35)
  Top 0.305: J1.3 46.87,29.73 v47,29.6
  Bottom 0.305: IC2.25 62.11,28.7 47.9,28.7 v47,29.6 34.43,17.03 IC1.25

### Text on the board
tPlace: TSIU51: MikroDator projekt / Skittle Sort / 06/02-2020 / Version: 1 / JS